# EasyEDA Pro project ProPrj_LXBRC-STM32F405飞控_2024-08-19.epro, board LXBRC-F405_V1.1
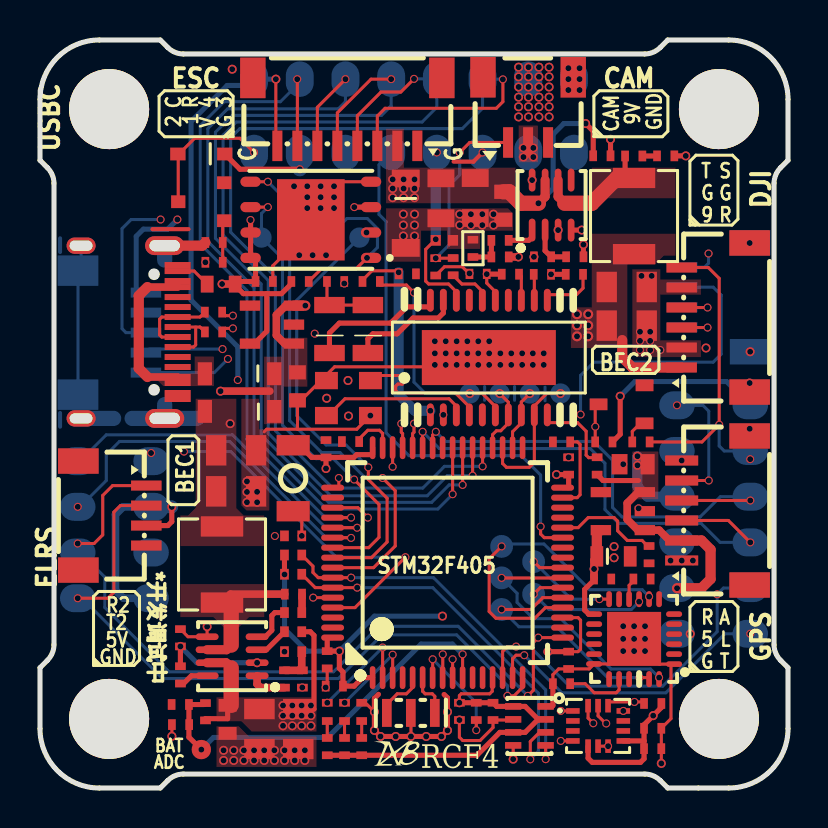
[diagram p3: board, top side]
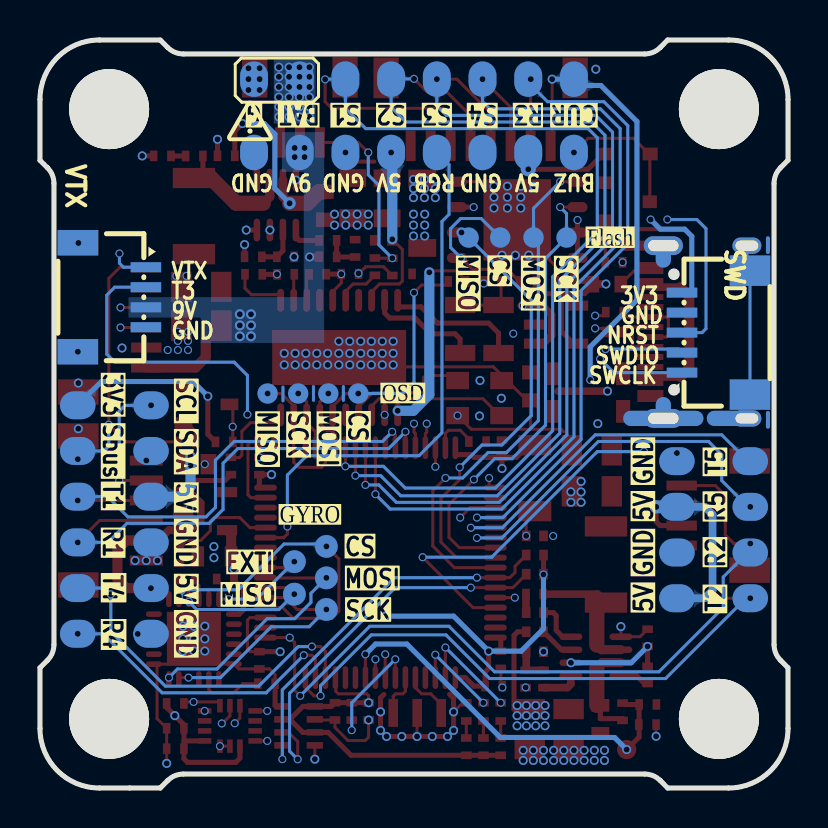
[diagram p4: board, bottom side, seen from below]

Outline 37.42 x 37.42 mm; copper layers: Top Layer, GND, PWR, Bottom Layer. Coordinates in mm from the lower left corner of the outline.
Outline path: 0,34.45 arc(0.87,36.55) 2.97,37.42 6.02,37.42 6.39,37.04 arc(6.75,36.8) 7.18,36.72 30.24,36.72 arc(30.67,36.8) 31.03,37.04 31.4,37.41 34.45,37.41 arc(36.55,36.55) 37.42,34.45 37.42,31.4 37.04,31.03 arc(36.8,30.67) 36.72,30.24 36.72,7.18 arc(36.8,6.75) 37.04,6.39 37.42,6.02 37.42,2.97 arc(36.55,0.87) 34.45,0 31.4,0 31.03,0.37 arc(30.67,0.61) 30.24,0.7 7.18,0.7 arc(6.75,0.61) 6.39,0.37 6.02,0 2.97,0 arc(0.87,0.87) 0,2.97 0,6.02 0.37,6.39 arc(0.61,6.75) 0.7,7.18 0.7,30.24 arc(0.61,30.67) 0.37,31.03 0,31.4 0,34.45
Stack: Top Layer 0.035mm 外层铜厚1oz / Dielectric1 0.2104mm 7628 RC49% 8.6mil / GND 0.035mm - / Dielectric2 1.065mm 1.1mm H/HOZ 含铜 / PWR 0.035mm - / Dielectric3 0.2104mm 7628 RC49% 8.6mil / Bottom Layer 0.035mm 外层铜厚1oz

## Design rules (mm)
net USB_DM: USB2
net USB_DP: USB2
net D+: USB
net D-: USB
template: 用户自定义配置
spacing Default (default): track to track 0.152, other pairs 0 to 0.152
track width Default (default): min 0.152, default 0.152, max 25.4
differential pair differentialPair (default): width min 0.127, default 0.254, max 2.54; gap min 0.152, default 0.152
via Default (default): diameter min 0.127, default 0.61, max 100.025; hole min 0.127, default 0.305, max 59.995

## Placement (name value [footprint] x y rotation side)
3V3  -  [led_0402]  16.09 3.81 270 top
AT7456E  AT7456E  [tssop-28_l9.7-w4.4-p0.65-ls6.4-bl-ep-2]  22.45 21.53 0 top
BMP280  BMP280  [wlga-8_l2.5-w2.0-p0.65-tr_dps422]  24.48 3.11 0 top
BOOT  TS2306A 200gf 002  [sw-smd_l3.0-w2.0-ls3.5]  12.66 15.5 90 top
C1A1  10uF  [c0805#2]  10.97 2.95 90 top
C1A2  10uF  [c0805]  21.77 29.51 90 top
C1B1  10uF  [c0805#2]  12.92 2.95 90 top
C1B2  10uF  [c0805]  20.05 29.5 90 top
C1C1  0.1uF  [c0603#2]  9.39 3.44 90 top
C1C2  0.1uF  [c0603#3]  23.17 29.12 90 top
C2A1  22uF  [c0805#2]  9.81 16.89 180 top
C2A2  22uF  [c0805#2]  29.35 25.06 180 top
C2B1  22uF  [c0805#2]  9.81 14.84 180 top
C2B2  22uF  [c0805#2]  29.35 23.13 180 top
C7  100nF  [C0402]  22.66 3.83 90 top
C8  100nF  [C0402]  11.21 25.34 180 top
C13  100nF  [c0402]  7.03 3.17 180 top
C19  1uF  [c0603]  12.88 20.09 90 top
C20  1uF  [c0603#4]  9.06 25.2 0 top
C21  100nF  [c0603#5]  29.69 16.2 0 top
C22  1uF  [cap-smd_l1.6-w0.8-rd]  28.69 11.59 180 top
C32  100nF  [C0402]  14.72 5.1 180 top
C33  100nF  [C0402]  26.44 16.11 90 top
C34  100nF  [C0402]  14.31 16.97 90 top
C35  100nF  [C0402]  20.98 3.83 270 top
C36  100nF  [C0402]  14.37 6.41 270 top
C37  100nF  [C0402]  26.44 6.39 270 top
C40  100nF  [C0402]  30.11 10.45 0 top
C41  100nF  [C0402]  28.14 10.45 180 top
C42  2.2nF  [C0402]  26.09 5.22 180 top
C203  100nF  [C0402]  12.67 9.7 180 top
C207  47uF  [case-a_3216]  16.4 22.96 90 top
C208  47uF  [case-a_3216]  14.48 22.96 90 top
C209  100nF  [c0402]  18.37 25.72 180 top
C210  100nF  [c0402#2]  20.23 27.39 180 top
C211  100nF  [c0402]  21.91 25.72 0 top
C212  100nF  [c0402]  20.67 26.08 90 top
C242  2.2uF  [C0402]  26.09 17.31 180 top
C243  2.2uF  [C0402]  15.53 17.33 180 top
C244  100nF  [C0402]  7.02 7.51 270 top
C245  100nF  [C0402]  29.7 31.61 180 top
C246  100nF  [C0402]  25.14 26.57 0 top
C247  100nF  [C0402]  30.65 1.97 0 top
C248  10nF  [C0402]  30.65 2.99 0 top
CAM  WTB01W03BB  [conn-smd_3p-p1.00_bzcn_wtb01w03bb]  24.41 33.54 0 top
D1  B5819WS  [sod-323_l1.8-w1.3-ls2.5-rd]  8.07 31.71 180 top
D301  SMF33A  [sod-123fl_l2.7-w1.8-ls3.8-rd]  18.3 28.75 270 top
D305  B5819W  [sod-123f_l2.7-w1.6-ls3.8-rd-1]  9.98 20.72 180 top
D306  B5819W  [sod-123f_l2.7-w1.6-ls3.8-rd-1]  9.98 18.84 180 top
DJI  ZX-SH1.0-6PWT  [conn-smd_6p-p1.00_megastar_zx-sh1.0-6pwt#2]  33.8 23.53 90 top
ELRS  ZX-SH1.0-4PWT  [conn-smd_4p-p1.00_megastar_zx-sh1.0-4pwt]  3.62 13.63 270 top
ESC  A1002WR-S-8P  [conn-smd_8p-p1.00_megastar_zx-sh1.0-8pwt]  15.37 33.82 180 top
FC  -  [led_0402]  14.37 3.81 270 top
G2  -  [通孔焊盘#4]  35.53 10 180 bottom
G3  -  [通孔焊盘]  35.53 7.72 180 top
G4  -  [通孔焊盘]  1.89 9.49 0 top
G7  -  [通孔焊盘]  35.53 14.57 180 top
G8  -  [通孔焊盘]  35.53 12.29 0 top
G9  -  [通孔焊盘#2]  12.73 27.53 0 top
G10  -  [通孔焊盘#2]  15.98 27.53 0 top
G11  -  [通孔焊盘#2]  11.08 27.53 0 top
G12  -  [通孔焊盘#2]  14.4 27.53 0 top
G13  -  [通孔焊盘]  1.89 11.78 180 top
G14  -  [通孔焊盘#4]  31.86 16.86 0 bottom
G15  -  [通孔焊盘#4]  31.86 19.14 0 bottom
G16  -  [通孔焊盘#3]  23.09 12.09 180 top
G17  -  [通孔焊盘#3]  23.09 8.93 90 top
G18  -  [通孔焊盘#3]  24.69 9.7 90 top
G19  -  [通孔焊盘#3]  23.09 10.51 90 top
G20  -  [通孔焊盘#3]  24.69 11.32 90 top
G21  -  [通孔焊盘#2]  22.99 19.73 90 top
G22  -  [通孔焊盘#2]  26.03 19.73 90 top
G23  -  [通孔焊盘#2]  24.5 19.73 90 top
G24  -  [通孔焊盘#2]  21.5 19.73 90 top
GPS  ZX-SH1.0-6PWT  [conn-smd_6p-p1.00_megastar_zx-sh1.0-6pwt]  33.8 13.88 90 top
HP15  -  [通孔焊盘#5]  8.07 1.92 0 bottom
ICM-42688P  ICM-42688-P  [LGA-14_L3.0-W2.5-P0.50-TL]  27.92 3.11 0 top
L201  10uH  [ind-smd_l4.4-w4.2]  9.11 11.18 270 top
L202  10uH  [ind-smd_l4.4-w4.2]  29.71 28.61 90 top
LDO  CJ6206B33M  [sot-23-5_l2.9-w1.6-p0.95-ls2.8-bl]  11.6 23.18 90 top
LDO_GYRO  CJ6206B33M  [sot-23-5_l2.9-w1.6-p0.95-ls2.8-bl]  29.16 13.85 90 top
LXB  -  [led_0402]  15.23 3.81 270 top
MP9943_5V  MP9943GQ-Z  [qfn-8_l3.0-w3.0-p0.65-bl]  9.61 6.59 90 top
MP9943_9V  MP9943GQ-Z  [qfn-8_l3.0-w3.0-p0.65-bl]  25.59 29.16 0 top
MPU6000  MPU-6000  [qfn-24_l4.0-w4.0-p0.50-bl-ep2.7]  29.72 7.45 90 top
NOREF  -  [Pad_e38]  22.14 35.46 90 top
NOREF#2  -  [Pad_e51]  24.42 31.79 90 top
NOREF#3  -  [Pad_e94]  12.99 31.79 270 top
NOREF#4  -  [Pad_e54]  12.99 35.46 270 top
NOREF#5  -  [Pad_e43]  31.86 14.57 0 top
NOREF#6  -  [Pad_e30]  10.71 35.46 90 top
NOREF#7  -  [Pad_e27]  5.56 14.06 0 top
NOREF#8  -  [Pad_e25]  26.71 35.46 90 top
NOREF#9  -  [Pad_e41]  31.86 10 0 top
NOREF#10  -  [Pad_e525]  1.89 16.35 0 top
NOREF#11  -  [Pad_e40]  31.86 7.72 0 top
NOREF#12  -  [Pad_e99]  10.71 31.79 90 top
NOREF#13  -  [Pad_e45]  31.86 12.29 0 top
NOREF#14  -  [Pad_e18]  35.53 19.14 0 top
NOREF#15  -  [Pad_e26]  15.28 35.46 90 top
NOREF#16  -  [Pad_e1174]  3.46 3.46 225 top
NOREF#17  -  [Pad_e113]  22.14 31.79 90 top
NOREF#18  -  [Pad_e55]  26.71 31.79 90 top
NOREF#19  -  [Pad_e112]  17.56 31.79 90 top
NOREF#20  -  [Pad_e566]  5.56 9.49 0 top
NOREF#21  -  [Pad_e36]  17.56 35.46 270 top
NOREF#22  -  [Pad_e1169]  3.46 33.96 135 top
NOREF#23  -  [Pad_e1170]  33.96 33.96 225 top
NOREF#24  -  [Pad_e33]  24.42 35.46 90 top
NOREF#25  -  [Pad_e534]  5.56 11.78 0 top
NOREF#26  -  [Pad_e28]  19.85 35.46 270 top
NOREF#27  -  [Pad_e95]  15.28 31.79 270 top
NOREF#28  -  [Pad_e1171]  33.96 3.46 135 top
NOREF#29  -  [Pad_e522]  1.89 14.06 0 top
NOREF#30  -  [Pad_e114]  19.85 31.79 90 top
NOREF#31  -  [Pad_e24]  5.56 16.35 0 top
Q1  -  [s8050_sot-23]  8.06 29.2 0 top
Q2  -  [s8050_sot-23#2]  29.09 19.06 0 top
R3  560R  [r0402#2]  15.23 2.07 270 top
R4  560R  [r0402#2]  14.37 2.07 270 top
R11  10K  [r0402#2]  13.01 25.34 180 top
R16  10K  [r0402#2]  21.82 3.83 90 top
R17  27  [r0402#2]  8.68 23.8 180 top
R18  27  [r0402#2]  8.68 22.81 180 top
R20  10K  [r0402]  12.66 12.61 0 top
R21  1K  [r0402#2]  7.02 4.18 0 top
R22  10K  [r0402#2]  8.28 3.81 270 top
R23  10K  [r0402#2]  30.46 11.67 90 top
R24  100R  [r0402#2]  8.71 26.3 180 top
R25  10K  [r0402#2]  8.71 27.29 0 top
R26  10K  [r0402#2]  28.2 17.31 0 top
R27  1K  [r0402#2]  30.06 17.31 0 top
R30  4.7K  [r0402]  12.66 11.65 180 top
R31  4.7K  [r0402]  12.66 10.69 180 top
R207  1K  [r0402#2]  27.87 16.11 270 top
R208  1K  [r0402#2]  26.73 25.7 180 top
R209  1K  [r0402#2]  25.13 25.7 0 top
R210  1K  [r0402#2]  23.53 25.7 180 top
R211  75R  [r0402#2]  19.79 26.07 90 top
R212  75R  [r0402#2]  14.79 25.34 0 top
R230  20R  [r0402]  12.66 8.77 0 top
R231  41.2K  [r0402]  12.66 6.82 180 top
R232  7.68K  [r0402#2]  13.12 5.45 90 top
R233  51K  [r0402#2]  12.23 5.45 270 top
R234  1M  [r0402]  12.66 7.82 0 top
R235  100K  [r0402#2]  7.02 5.66 90 top
R236  20R  [r0402#2]  31.3 31.62 180 top
R237  41.2K  [r0402#2]  23.01 26.56 0 top
R238  4k  [r0402#2]  21.66 26.99 270 top
R239  51K  [r0402#2]  23.01 27.39 0 top
R240  1M  [r0402#2]  28.1 31.62 180 top
R241  100K  [r0402#2]  26.75 26.57 180 top
R242  10K  [r0402#2]  30.65 4.23 0 top
R243  10K  [r0402#2]  16.56 25.34 180 top
R244  560R  [r0402#2]  16.09 2.07 270 top
RC1  -  [通孔焊盘]  35.53 16.86 180 top
STM32F405  STM32F405RGT6V  [lqfp-64_l10.0-w10.0-p0.50-ls12.0-bl]  20.39 11.27 0 top
SWD  A1002WR-S-5P  [conn-smd_5p-p1.00_megastar_zx-sh1.0-5pwt]  3.6 22.78 90 bottom
USBC  KH-TYPE-C-16P  [usb-c-smd_kh-type-c-16p]  4.47 22.81 270 top
VTX  ZX-SH1.0-4PWT  [conn-smd_4p-p1.00_megastar_zx-sh1.0-4pwt]  33.82 24.55 270 bottom
W25Q128  W25Q128JVPIQ  [wson-8_l6.0-w5.0-p1.27-bl-ep]  13.55 28.42 90 top
X2  8MHz  [osc-smd_3p-l3.2-w1.3-p1.2-l]  18.55 3.76 180 top
X3  27MHz  [osc-smd_4p-l3.2-w2.5-bl]  15.43 19.5 180 top

## Footprints (pads in the part's own frame, mm; a bottom-side part is the same pattern mirrored in y, then rotated)
c0402
  rect 0.381x0.508 smd: 1(-0.432,0) 2(0.432,0)
c0402#2
  rect 0.508x0.533 smd: 1(-0.432,0) 2(0.432,0)
C0402
  rect 0.381x0.533 smd: 1(-0.432,0) 2(0.432,0)
c0603
  rect 0.711x0.838 smd: 1(-0.7,0) 2(0.7,0)
c0603#2
  rect 0.635x0.9 smd: 1(-0.7,0) 2(0.7,0)
c0603#3
  rect 0.711x0.9 smd: 1(-0.7,0) 2(0.7,0)
c0603#4
  rect 0.635x0.838 smd: 1(-0.7,0) 2(0.7,0)
c0603#5
  rect 0.787x1.016 smd: 1(-0.7,0)
  rect 0.711x1.016 smd: 2(0.7,0)
c0805
  rect 0.889x1.346 smd: 1(-1,0) 2(1,0)
c0805#2
  rect 1.016x1.524 smd: 1(-1,0) 2(1,0)
cap-smd_l1.6-w0.8-rd
  rect 0.635x1.016 smd: 1(0.835,0) 2(-0.835,0)
case-a_3216
  rect 0.813x1.524 smd: 1(-1.2,0) 2(1.2,0)
conn-smd_3p-p1.00_bzcn_wtb01w03bb
  rect 0.5x1.524 smd: 1(-1,-1.25) 2(0,-1.25) 3(1,-1.25)
  rect 1.27x2.032 smd: 4(2.257,2.013) 5(-2.257,2.013)
conn-smd_4p-p1.00_megastar_zx-sh1.0-4pwt
  rect 0.5x1.524 smd: 1(-1.5,1.7) 2(-0.5,1.7) 3(0.5,1.7) 4(1.5,1.7)
  rect 1.27x2.032 smd: 5(2.727,-1.7) 6(-2.727,-1.7)
conn-smd_5p-p1.00_megastar_zx-sh1.0-5pwt
  rect 0.5x1.524 smd: 1(-2,1.7) 2(-1,1.7) 3(0,1.7) 4(1,1.7) 5(2,1.7)
  rect 1.524x2.032 smd: 6(3.1,-1.7) 7(-3.1,-1.7)
conn-smd_6p-p1.00_megastar_zx-sh1.0-6pwt
  rect 0.5x1.651 smd: 1(-2.5,1.7) 2(-1.5,1.7) 3(-0.5,1.7) 4(0.5,1.7) 5(1.5,1.7) 6(2.5,1.7)
  rect 1.27x2.032 smd: 7(3.727,-1.7) 8(-3.727,-1.7)
conn-smd_6p-p1.00_megastar_zx-sh1.0-6pwt#2
  rect 0.5x1.524 smd: 1(-2.5,1.7) 2(-1.5,1.7) 3(-0.5,1.7) 4(0.5,1.7) 5(1.5,1.7) 6(2.5,1.7)
  rect 1.27x2.032 smd: 7(3.727,-1.7) 8(-3.727,-1.7)
conn-smd_8p-p1.00_megastar_zx-sh1.0-8pwt
  rect 0.5x1.524 smd: 1(-3.5,1.7) 2(-2.5,1.7) 3(-1.5,1.7) 4(-0.5,1.7) 5(0.5,1.7) 6(1.5,1.7) 7(2.5,1.7) 8(3.5,1.7)
  rect 1.27x2.032 smd: 9(4.727,-1.7) 10(-4.727,-1.7)
ind-smd_l4.4-w4.2
  rect 1.016x2.12 smd: 1(1.905,0) 2(-1.905,0)
led_0402
  rect 0.381x0.533 smd: 1(-0.457,0) 2(0.457,0)
LGA-14_L3.0-W2.5-P0.50-TL
  rect 0.675x0.28 smd: 1(-1.262,0.75) 2(-1.262,0.25) 3(-1.262,-0.25) 4(-1.262,-0.75) 8(1.262,-0.75) 9(1.262,-0.25) 10(1.262,0.25) 11(1.262,0.75)
  rect 0.28x0.675 smd: 5(-0.5,-1.012) 6(0,-1.012) 7(0.5,-1.012) 12(0.5,1.012) 13(0,1.012) 14(-0.5,1.012)
lqfp-64_l10.0-w10.0-p0.50-ls12.0-bl
  oval 0.28x1.143 smd: 1(-3.75,-5.75) 2(-3.25,-5.75) 3(-2.75,-5.75) 4(-2.25,-5.75) 5(-1.75,-5.75) 6(-1.25,-5.75) 7(-0.75,-5.75) 8(-0.25,-5.75) 9(0.25,-5.75) 10(0.75,-5.75) 11(1.25,-5.75) 12(1.75,-5.75) 13(2.25,-5.75) 14(2.75,-5.75) 15(3.25,-5.75) 16(3.75,-5.75) 33(3.75,5.75) 34(3.25,5.75) 35(2.75,5.75) 36(2.25,5.75) 37(1.75,5.75) 38(1.25,5.75) 39(0.75,5.75) 40(0.25,5.75) 41(-0.25,5.75) 42(-0.75,5.75) 43(-1.25,5.75) 44(-1.75,5.75) 45(-2.25,5.75) 46(-2.75,5.75) 47(-3.25,5.75) 48(-3.75,5.75)
  oval 1.143x0.3 smd: 17(5.75,-3.75) 18(5.75,-3.25) 19(5.75,-2.75) 20(5.75,-2.25) 21(5.75,-1.75) 22(5.75,-1.25) 23(5.75,-0.75) 24(5.75,-0.25) 25(5.75,0.25) 26(5.75,0.75) 27(5.75,1.25) 28(5.75,1.75) 29(5.75,2.25) 30(5.75,2.75) 31(5.75,3.25) 32(5.75,3.75) 49(-5.75,3.75) 50(-5.75,3.25) 51(-5.75,2.75) 52(-5.75,2.25) 53(-5.75,1.75) 54(-5.75,1.25) 55(-5.75,0.75) 56(-5.75,0.25) 57(-5.75,-0.25) 58(-5.75,-0.75) 59(-5.75,-1.25) 60(-5.75,-1.75) 61(-5.75,-2.25) 62(-5.75,-2.75) 63(-5.75,-3.25) 64(-5.75,-3.75)
osc-smd_3p-l3.2-w1.3-p1.2-l
  rect 0.482x1.397 smd: 1(-1.2,0) 2(0,0) 3(1.2,0)
osc-smd_4p-l3.2-w2.5-bl
  rect 1.143x0.864 smd: 1(-1.1,-0.875) 2(1.1,-0.875) 3(1.1,0.875) 4(-1.1,0.875)
Pad_e18
  rrect 1.778x1.397 smd far side: 1(0,0)
Pad_e24
  rrect 1.778x1.397 smd far side: 1(0,0)
Pad_e25
  rrect 1.778x1.397 smd far side: 1(0,0)
Pad_e26
  rrect 1.778x1.397 smd far side: 1(0,0)
Pad_e27
  rrect 1.778x1.397 smd far side: 1(0,0)
Pad_e28
  rrect 1.778x1.397 smd far side: 1(0,0)
Pad_e30
  rrect 1.778x1.397 smd far side: 1(0,0)
Pad_e33
  rrect 1.778x1.397 smd far side: 1(0,0)
Pad_e36
  rrect 1.778x1.397 smd far side: 1(0,0)
Pad_e38
  rrect 1.778x1.397 smd far side: 1(0,0)
Pad_e40
  rrect 1.778x1.397 smd far side: 1(0,0)
Pad_e41
  rrect 1.778x1.397 smd far side: 1(0,0)
Pad_e43
  rrect 1.778x1.397 smd far side: 1(0,0)
Pad_e45
  rrect 1.778x1.397 smd far side: 1(0,0)
Pad_e51
  rrect 1.778x1.397 smd far side: 1(0,0)
Pad_e54
  rrect 1.778x1.397 smd far side: 1(0,0)
Pad_e55
  rrect 1.778x1.397 smd far side: 1(0,0)
Pad_e94
  rrect 1.778x1.397 smd far side: 1(0,0)
Pad_e95
  rrect 1.778x1.397 smd far side: 1(0,0)
Pad_e99
  rrect 1.778x1.397 smd far side: 1(0,0)
Pad_e112
  rrect 1.778x1.397 smd far side: 1(0,0)
Pad_e113
  rrect 1.778x1.397 smd far side: 1(0,0)
Pad_e114
  rrect 1.778x1.397 smd far side: 1(0,0)
Pad_e522
  rrect 1.778x1.397 smd far side: 1(0,0)
Pad_e525
  rrect 1.778x1.397 smd far side: 1(0,0)
Pad_e534
  rrect 1.778x1.397 smd far side: 1(0,0)
Pad_e566
  rrect 1.778x1.397 smd far side: 1(0,0)
Pad_e1169
  oval 4x4 hole 4: 1(0,0)
Pad_e1170
  oval 4x4 hole 4: 1(0,0)
Pad_e1171
  oval 4x4 hole 4: 1(0,0)
Pad_e1174
  oval 4x4 hole 4: 1(0,0)
qfn-8_l3.0-w3.0-p0.65-bl
  oval 0.33x1.143 smd: 1(-0.975,-1.25) 2(-0.325,-1.25) 3(0.325,-1.25) 4(0.975,-1.25) 5(0.975,1.25) 6(0.325,1.25) 7(-0.325,1.25) 8(-0.975,1.25)
qfn-24_l4.0-w4.0-p0.50-bl-ep2.7
  oval 0.28x0.8 smd: 1(-1.25,-2) 2(-0.75,-2) 3(-0.25,-2) 4(0.25,-2) 5(0.75,-2) 6(1.25,-2) 13(1.25,2) 14(0.75,2) 15(0.25,2) 16(-0.25,2) 17(-0.75,2) 18(-1.242,2)
  oval 0.8x0.28 smd: 7(2,-1.25) 8(2,-0.75) 9(2,-0.25) 10(2,0.25) 11(2,0.75) 12(2,1.25) 19(-2,1.25) 20(-2,0.75) 21(-2,0.25) 23(-2,-0.75) 24(-2,-1.25)
  rect 2.7x2.7 smd: 25(0.013,0)
r0402
  rect 0.432x0.533 smd: 1(-0.433,0) 2(0.433,0)
r0402#2
  rect 0.381x0.533 smd: 1(-0.433,0) 2(0.433,0)
s8050_sot-23
  rect 0.711x0.635 smd: 1(1.15,-0.823) 2(1.15,1.077) 3(-1.15,0.127)
s8050_sot-23#2
  rect 0.889x0.584 smd: 1(1.15,-0.823) 2(1.15,1.077) 3(-1.15,0.127)
sod-123f_l2.7-w1.6-ls3.8-rd-1
  rect 0.711x1.143 smd: 1(-1.735,0) 2(1.735,0)
sod-123fl_l2.7-w1.8-ls3.8-rd
  rect 0.889x1.397 smd: 1(-1.735,0) 2(1.735,0)
sod-323_l1.8-w1.3-ls2.5-rd
  rect 0.762x0.635 smd: 1(-1.173,0) 2(1.173,0)
sot-23-5_l2.9-w1.6-p0.95-ls2.8-bl
  rect 0.508x1.016 smd: 1(-0.95,-1.1) 2(0,-1.1) 3(0.95,-1.1) 4(0.95,1.1) 5(-0.95,1.1)
sw-smd_l3.0-w2.0-ls3.5
  rect 1.016x1.651 smd: 1(-1.651,0) 2(1.651,0)
tssop-28_l9.7-w4.4-p0.65-ls6.4-bl-ep-2
  oval 0.343x1.143 smd: 3(-2.925,-2.866) 4(-2.275,-2.866) 5(-1.625,-2.866) 6(-0.975,-2.866) 7(-0.325,-2.866) 8(0.325,-2.866) 9(0.975,-2.866) 10(1.625,-2.866) 11(2.275,-2.866) 12(2.925,-2.866) 17(2.925,2.866) 18(2.275,2.866) 19(1.625,2.866) 20(0.975,2.866) 21(0.325,2.866) 22(-0.325,2.866) 23(-0.975,2.866) 24(-1.625,2.866) 25(-2.275,2.866) 26(-2.925,2.866)
  rect 6.7x2.75 smd: 29(0,0)
usb-c-smd_kh-type-c-16p
  oval 0.94x1.956 hole 0.559x1.524: 1(-4.32,1.765) 2(4.32,1.765)
  oval 0.813x1.448 hole 0.508x1.143: 3(-4.32,-2.415) 4(4.32,-2.415)
  rect 0.3x1.3 smd: A1(-3.35,2.415) A4(-2.55,2.415) A5(-1.25,2.415) A6(-0.25,2.415) A7(0.25,2.415) A8(1.25,2.415) A9(2.55,2.415) A12(3.35,2.415) B1(3.05,2.415) B4(2.25,2.415) B5(1.75,2.415) B6(0.75,2.415) B7(-0.75,2.415) B8(-1.75,2.415) B9(-2.25,2.415) B12(-3.05,2.415)
wlga-8_l2.5-w2.0-p0.65-tr_dps422
  rect 0.813x0.33 smd: 1(0.813,0.975) 2(0.813,0.325) 3(0.813,-0.325) 4(0.813,-0.975) 5(-0.813,-0.975) 6(-0.813,-0.325) 7(-0.813,0.325) 8(-0.813,0.975)
wson-8_l6.0-w5.0-p1.27-bl-ep
  oval 0.508x1.016 smd: 1(-1.905,-3.013) 2(-0.635,-3.013) 3(0.635,-3.013) 4(1.905,-3.013) 5(1.905,3.013) 6(0.635,3.013) 7(-0.635,3.013) 8(-1.905,3.013)
  rect 4.064x3.378 smd: 9(0,0)
通孔焊盘
  rrect 1.778x1.397 smd far side: 1(0,0)
通孔焊盘#2
  round 1.016 smd far side: 1(0,0)
通孔焊盘#3
  round 1.143 smd far side: 1(0,0)
通孔焊盘#4
  rrect 1.778x1.397 smd: 1(0,0)
通孔焊盘#5
  round 0.965 smd far side: 1(0,0)

## Nets
As in the schematic, except:
3V3: BMP280.2 BMP280.6 BMP280.8 BOOT.2 C7.2 C8.2 C20.2 C32.1 C33.1 C34.1 C35.1 C36.1 C37.1 LDO.5 NOREF#14.1 R3.2 R4.2 R11.2 R16.2 R26.2 R30.2 R31.2 R244.2 STM32F405.1 STM32F405.13 STM32F405.19 STM32F405.32 STM32F405.48 STM32F405.64 SWD.5 W25Q128.3 W25Q128.7 W25Q128.8
5V: AT7456E.3 AT7456E.21 AT7456E.24 C19.2 C21.2 C209.2 C210.2 C211.2 D1.1 D305.1 D306.1 ELRS.3 GPS.2 LDO.1 LDO.3 LDO_GYRO.1 LDO_GYRO.3 NOREF#3.1 NOREF#5.1 NOREF#7.1 NOREF#9.1 NOREF#20.1 NOREF#30.1 R207.2 R208.2 R209.2 R210.2 R243.2
GND: 3V3.1 AT7456E.4 AT7456E.20 AT7456E.23 AT7456E.29 BMP280.1 BMP280.5 BMP280.7 C1A1.1 C1A2.1 C1B1.1 C1B2.1 C1C1.1 C1C2.1 C2A1.1 C2A2.1 C2B1.1 C2B2.1 C7.1 C8.1 C13.2 C19.1 C20.1 C21.1 C22.2 C32.2 C33.2 C34.2 C35.2 C36.2 C37.2 C40.2 C41.1 C42.2 C209.1 C210.1 C211.1 C242.2 C243.2 C244.1 C246.1 C247.2 C248.2 CAM.3 CAM.4 CAM.5 D301.2 DJI.2 DJI.5 DJI.7 DJI.8 ELRS.4 ELRS.5 ELRS.6 ESC.1 ESC.9 ESC.10 GPS.1 GPS.7 GPS.8 ICM-42688P.6 ICM-42688P.7 ICM-42688P.11 LDO.2 LDO_GYRO.2 MP9943_5V.5 MP9943_9V.5 MPU6000.1 MPU6000.18 MPU6000.25 NOREF#8.1 NOREF#11.1 NOREF#13.1 NOREF#17.1 NOREF#18.1 NOREF#25.1 NOREF#27.1 NOREF#31.1 Q1.2 Q2.2 R20.1 R21.1 R23.1 R25.1 R211.1 R232.1 R238.1 STM32F405.12 STM32F405.18 STM32F405.63 SWD.4 SWD.6 SWD.7 USBC.1 USBC.2 USBC.3 USBC.4 USBC.A1 USBC.A12 USBC.B1 USBC.B12 VTX.4 VTX.5 VTX.6 W25Q128.4 W25Q128.9 X2.2 X3.2 X3.4
VBAT: C1A1.2 C1A2.2 C1B1.2 C1B2.2 C1C1.2 C1C2.2 D301.1 ESC.2 MP9943_5V.7 MP9943_9V.7 NOREF#24.1 R22.2 R234.2 R240.2
ADC_CURR: ESC.8 NOREF#6.1 STM32F405.9
BUZ-: D1.2 NOREF#12.1 Q1.3
DC_9V: C2A2.2 C2B2.2 CAM.2 DJI.1 L202.2 NOREF#2.1 R237.2 VTX.3
LED_STRIP: NOREF#19.1 STM32F405.27
S1: ESC.3 NOREF.1 STM32F405.37
S2: ESC.4 NOREF#26.1 STM32F405.38
S3: ESC.5 NOREF#21.1 STM32F405.39
S4: ESC.6 NOREF#15.1 STM32F405.40
UART5_RX: NOREF#29.1 STM32F405.54
UART5_TX: NOREF#10.1 STM32F405.53
USART3_RX: ESC.7 NOREF#4.1 STM32F405.52

Pads without a net: AT7456E 7; ICM-42688P 2 3 9 10; LDO 4; LDO_GYRO 4; MPU6000 2 3 4 5 6 7 11 14 15 16 17 19 21; NOREF#16 1; NOREF#22 1; NOREF#23 1; NOREF#28 1; STM32F405 4 11 25 26 29 30 33 41 50 62; USBC A5 A8 B5 B8

## Via types
v1: diameter 0.4, hole 0.3, Top Layer to Bottom Layer, 128 vias
v2: diameter 0.45, hole 0.3, Top Layer to Bottom Layer, 205 vias
v3: diameter 0.5, hole 0.3, Top Layer to Bottom Layer, 6 vias
v4: diameter 0.61, hole 0.305, Top Layer to Bottom Layer, 1 via

## Routing (per net, layer and track width the routed paths; a pad name or vN(x,y) marks a point on that pad's centre or on a via; arc(x,y) is an arc through that point)
3V3: length 138.1
  Top Layer w0.152: STM32F405.19 26.91,8.52 27.04,8.4 27.04,6.95 26.91,6.82 C37.1 ; v2(20.98,4.27) 20.98,4.62 21.07,4.71 22.49,4.71 22.62,4.84 22.62,5.5 STM32F405.13
  Top Layer w0.254: 11.34,24.73 10.17,24.73 9.76,25.14 C20.2 9.89,25.34 C8.2 10.78,26.52 W25Q128.8 W25Q128.7 10.53,28.41 v1(10.53,28.41) ; 11.34,24.73 12.08,24.73 12.57,25.22 R11.2 ; 11.34,24.73 11.34,22.85 10.72,22.23 10.45,22.23 ; v2(25.83,15.68) C33.1 26.44,15.02 STM32F405.32 ; C34.1 15.7,16.54 15.84,16.68 16.64,16.68 STM32F405.48 ; C34.1 v2(14.31,15.98) ; C34.1 13.59,16.54 12.98,17.15 BOOT.2 ; 24.92,3.43 24.27,2.78 BMP280.6 23,2.78 21.86,1.64 R244.2 R3.2 R4.2 ; 24.92,3.43 BMP280.2 ; 24.92,3.43 24.27,4.08 BMP280.8 22.84,4.08 22.66,4.27 v2(20.98,4.27) ; R31.2 R30.2 ; R26.2 29.02,17.69 v2(29.02,19.6) ; STM32F405.64 14.37,7.52 C36.1 v2(14.97,6.85) 14.97,5.98 15.15,5.8 C32.1 15.71,5.1 16.14,5.52 STM32F405.1 ; v2(25.4,6.82) C37.1 ; v1(15.72,29.06) W25Q128.3
  Top Layer w0.381: C20.2 9.76,25.21 v2(9.11,25.21)
  PWR w0.254: 22.31,4.27 v2(20.98,4.27) ; 22.31,4.27 22.58,4 24.93,4 25.4,4.47 v2(25.4,6.82) 25.4,7.9 24.19,9.11 24.19,15.09 24.78,15.68 v2(25.83,15.68) 27.78,15.68 29.02,16.92 v2(29.02,19.6) ; 22.31,4.27 22.31,6.41 v2(20.13,8.6) 16.13,8.6 14.97,9.75 14.97,14.19 14.31,14.85 v2(14.31,15.98) 12.33,17.95 12.33,18.81 10.24,20.91 9.28,20.91 8.65,21.54 8.65,24.75 v2(9.11,25.21) ; v1(6.87,28.44) 6.9,28.41 v1(10.53,28.41) 15.08,28.41 v1(15.72,29.06)
  Bottom Layer w0.254: v2(20.13,8.6) 16.73,8.6 v2(14.97,6.85) 13.35,6.85 12.23,7.96 v1(12.23,10.68) ; v1(6.87,28.44) 6.39,27.95 5.17,27.95 4.81,27.6 4.81,24.78 SWD.5 ; NOREF#14.1 34.34,20.33 29.76,20.33 v2(29.02,19.6)
3V3_GYRO: length 23.6
  Top Layer w0.254: C247.1 30.21,2.36 ; 30.21,2.36 C248.1 30.21,3.16 v2(30.67,3.62) 31.08,4.03 R242.2 ; 30.21,2.36 ICM-42688P.8 ; MPU6000.13 27.45,8.7 27.24,8.9 27.24,9.93 27.76,10.45 ; ICM-42688P.5 27.42,1.49 27.62,1.28 30.04,1.28 30.21,1.46 30.21,1.97
  Top Layer w0.381: 27.71,10.5 v2(27.71,10.96) 27.71,11.4 27.9,11.59
  Top Layer w0.508: 28.11,12.9 27.85,12.9 27.85,11.64
  PWR w0.254: v2(30.67,3.62) 30.67,3.98 31.94,5.25 31.94,8.8 29.79,10.96 v2(27.71,10.96)
5V: length 104.9
  Top Layer w0.152: v1(22.35,25.7) 22.35,25.26 22.78,24.83 AT7456E.21 ; AT7456E.24 20.83,24.82 20.43,25.21 19.44,25.21 19.29,25.36 19.29,26.94 v1(19.79,27.45) ; R243.2 16.13,25.4 16.6,25.87 17.79,25.87
  Top Layer w0.254: R207.2 28.16,15.38 29.93,15.38 ; R210.2 23.09,25.7 v1(22.35,25.7) ; D1.1 10,30.95 v1(12.99,30.95) ; v1(25.56,25.7) R208.2 ; v2(6.59,14.06) 6.59,13.32 6.4,13.13 ELRS.3
  Top Layer w0.381: v2(9.03,19.85) 11.49,19.85 ; 30.31,14.8 29.92,14.8 29.37,14.25 29.37,13.43 29.91,12.9 30.97,12.9 31.49,12.38 GPS.2 ; 12.68,24.13 12.29,24.13 11.82,23.66 11.82,22.64 12.24,22.23 12.68,22.23
  Top Layer w0.508: GPS.2 33.09,12.38 33.54,11.93 33.54,10.45 33.08,10 v2(31.86,10) ; v1(13.27,24.13) LDO.3
  PWR w0.381: 16.9,25.79 16.9,30.13 16.09,30.95 13.04,30.95 ; 16.9,25.79 v1(17.94,25.79) 19.59,27.45 v1(19.79,27.45) 20.6,27.45 v1(22.35,25.7) 25.55,25.7 v1(25.56,25.7) ; 16.9,25.79 14.94,25.79 v1(13.27,24.13)
  PWR w0.508: v2(29.88,16.14) v2(29.88,16.6) 29.88,19.88 29.3,20.46 20.11,20.46 19.53,19.88 v1(19.53,18.87) ; v2(9.03,19.85) 8.52,19.34 8.52,15.99 v2(6.59,14.06)
  Bottom Layer w0.381: NOREF#20.1 4.17,9.49 3.77,9.89 3.77,13.68 4.16,14.06 NOREF#7.1
  Bottom Layer w0.508: v1(17.94,25.79) 17.94,19.68 18.75,18.87 v1(19.53,18.87) ; NOREF#5.1 30.39,14.57 29.88,15.08 v2(29.88,16.14) v2(29.88,16.6) ; v1(19.79,27.45) 19.79,31.73 v1(19.85,31.79)
  Bottom Layer w0.635: NOREF#7.1 6.59,14.06 v2(6.59,14.06)
  Bottom Layer w0.762: 12.99,30.98 NOREF#3.1
GND: length 83.4
  Top Layer w0.152: MPU6000.1 31.56,6.2 ; 31.56,6.2 30.98,6.2 v2(29.72,7.46) 28.46,6.21 MPU6000.18 27.47,5.96 C37.2 25.94,5.96 25.65,5.67 C42.2 ; 31.56,6.2 31.56,3.47 31.08,2.99 v2(31.08,1.23) ; C20.1 7.71,25.86 USBC.B12 ; AT7456E.29 21.99,21.07 14.74,21.07 13.06,19.39 C19.1 12.88,17.95 ; BMP280.7 23.64,3.4 C7.1 22.66,3.03 22.01,2.38 21.15,2.38 20.98,2.54 v2(20.98,3.4) ; v2(18.56,2.58) 18.56,3.75 X2.2 ; W25Q128.4 14.93,30.33 v2(14.71,30.1) ; ICM-42688P.6 v1(28.42,2.09) ; 3V3.1 16.27,4.27 v2(16.73,3.81) ; C32.2 14.37,5.17 C36.2 ; 12.88,17.95 11.34,17.95 11.21,17.82 ; 12.88,17.95 15.84,17.95 v1(16.53,18.63) ; 19.79,25.64 20.23,26.07 21.12,26.07 21.45,25.74 v1(21.48,25.74) ; C244.1 7.4,7.57 8.36,7.57 v2(8.36,8.07) ; W25Q128.9 13.55,28.02 11.65,26.12 C8.1 ; BMP280.5 v2(23.67,1.44) ; 35.5,20.26 DJI.8 ; 6.6,2.59 C13.2
  Top Layer w0.203: 5.63,27.95 7.43,27.95 ; 20.69,31.33 21.68,31.33 v1(22.14,31.79)
  Top Layer w0.254: 16.93,4.69 16.73,4.48 v2(16.73,3.81) v2(16.73,2.88) v2(17.03,2.58) v2(17.79,2.58) v2(18.56,2.58) v2(19.32,2.58) v2(20.08,2.58) v2(20.38,2.88) v2(20.38,3.81) 20.38,4.51 20.21,4.68 ; C42.2 25.65,4.13 25.61,4.08 BMP280.1
  Top Layer w0.508: USBC.1 8.11,27.13 R25.1
  Bottom Layer w0.152: USBC.3 2.06,26.03 SWD.6 SWD.7 ; 22.24,20.08 22.24,19.39 ; 23.74,20.08 23.74,19.39 ; 25.26,20.05 25.26,19.37
  Bottom Layer w0.203: 1,27.5 1,26.81 ; 1,18.76 1,18.07
  Bottom Layer w0.762: USBC.2 7.86,18.49 ; USBC.2 6.24,19.17 ; USBC.2 4.61,18.49 ; 6.24,26.41 USBC.1 ; USBC.4 3.68,18.49
  vias: v1(5.56,16.76) v1(11.75,12.61) v1(13.12,5.03) v1(13.74,22.73) v1(14.29,5.03) v1(20.18,18.67) v1(26.44,16.54) v1(29.17,16.2) v1(29.18,3.86) v1(29.94,13.99) v1(30.01,22.82) v1(30.01,22.37) v1(30.01,21.91) v1(30.09,25.62) v1(30.52,22.82) v1(30.52,22.37) v1(30.52,21.91) v1(30.59,25.62) v1(31.03,21.91) v2(6.6,2.59) v2(9.18,1.89) v2(9.18,1.38) v2(9.61,35.95) v2(9.69,1.89) v2(9.69,1.38) v2(10.2,1.89) v2(10.2,1.38) v2(10.35,15.34) v2(10.35,14.81) v2(10.35,14.29) v2(10.71,1.89) v2(10.71,1.38) v2(10.86,14.82) v2(10.86,14.29) v2(11.21,1.89) v2(11.21,1.38) v2(11.72,1.89) v2(11.72,1.38) v2(12.23,1.89) v2(12.23,1.38) v2(12.71,30.1) v2(12.74,1.89) v2(12.74,1.38) v2(12.97,26.65) v2(13.25,1.89) v2(13.25,1.38) v2(13.37,30.1) v2(13.37,29.55) v2(13.37,29.01) v2(13.64,26.65) v2(14.04,30.1) v2(14.04,29.55) v2(14.04,29.01) v2(14.31,26.65) v2(14.34,19.5) v2(14.71,29.55) v2(14.71,29.01) v2(15.41,20.38) v2(15.43,18.61) v2(18.17,28.7) v2(18.17,28.16) v2(18.17,27.61) v2(18.73,28.7) v2(18.73,28.16) v2(18.73,27.61) v2(19.75,22.35) v2(19.75,21.74) v2(19.75,21.17) v2(20.3,22.35) v2(20.3,21.74) v2(20.3,21.17) v2(20.84,22.35) v2(20.84,21.74) v2(20.84,21.17) v2(20.99,28.7) v2(20.99,28.16) v2(21.37,22.35) v2(21.37,21.74) v2(21.37,21.17) v2(21.55,28.7) v2(21.55,28.16) v2(21.92,22.35) v2(21.92,21.74) v2(21.92,21.17) v2(22.12,28.7) v2(22.12,28.16) v2(22.47,22.35) v2(22.47,21.74) v2(22.47,21.17) v2(22.68,28.7) v2(22.68,28.16) v2(23.03,21.74) v2(23.03,21.17) v2(23.57,21.74) v2(23.57,21.17) v2(24.12,21.74) v2(24.12,21.17) v2(24.71,26.57) v2(24.65,21.74) v2(24.65,21.17) v2(25.2,21.74) v2(25.2,21.17) v2(26.43,36.01) v2(26.43,35.46) v2(26.43,34.91) v2(26.99,36.01) v2(26.99,35.46) v2(26.99,34.91) v2(28.72,12.08) v2(28.72,11.52) v2(29.17,8.09) v2(29.17,7.46) v2(29.17,6.85) v2(29.72,8.09) v2(29.72,6.85) v2(30.26,8.09) v2(30.26,7.46) v2(30.26,6.85) v2(31.54,11.38) v2(32.1,11.38) v2(32.53,7.71) v2(32.66,11.38) v2(33.31,22.01) v2(35.5,27.26) v2(35.52,21.82) v2(35.5,20.26) v2(35.5,17.97)
VBAT: length 21.1
  Top Layer w0.152: C1C1.2 9.56,4.14
  Top Layer w0.254: R22.2 8.28,3.47 9.39,3.47 C1C1.2 ; R234.2 13.52,7.82 13.7,7.63 13.7,3.95 C1B1.2 ; R240.2 27.67,32.86 v2(27.29,33.24)
  Top Layer w0.457: MP9943_5V.7 9.3,6.27 9.56,6.01 ; v4(24.93,29.25) 25.26,29.58 MP9943_9V.7
  Top Layer w0.762: 9.56,6.01 9.56,4.14 ; v4(24.93,29.25) 24.04,29.25 23.47,29.82 C1C2.2
  Bottom Layer w0.254: v2(27.29,33.24) 26.2,33.24 25.67,32.7 25.67,29.99 v4(24.93,29.25)
  vias: v2(12.15,4.13) v2(12.15,3.62) v2(12.15,3.11) v2(12.62,4.13) v2(12.62,3.62) v2(12.62,3.11) v2(13.09,4.13) v2(13.09,3.62) v2(13.09,3.11) v2(13.55,4.13) v2(13.55,3.62) v2(13.55,3.11) v2(17.64,30.44) v2(17.64,29.99) v2(17.64,29.53) v2(18.19,30.44) v2(18.19,29.99) v2(18.19,29.53) v2(18.73,30.44) v2(18.73,29.99) v2(18.73,29.53) v2(23.94,36.06) v2(23.94,35.57) v2(23.94,35.07) v2(23.94,34.56) v2(23.94,34.07) v2(23.94,33.57) v2(24.44,36.06) v2(24.44,35.57) v2(24.44,35.07) v2(24.44,34.56) v2(24.44,34.07) v2(24.44,33.57) v2(24.96,36.06) v2(24.96,35.57) v2(24.96,35.07) v2(24.96,34.56) v2(24.96,34.07) v2(24.96,33.57) v2(25.46,36.06) v2(25.46,35.57) v2(25.46,35.07) v2(25.46,34.56) v2(25.46,34.07) v2(25.46,33.57)
ADC_CURR: length 44
  Top Layer w0.152: 11.75,32.12 11.74,32.12 ; ESC.8 11.8,32.2 11.8,35.46 ; v1(20.64,6.44) STM32F405.9
  PWR w0.254: v1(20.64,6.44) 20.64,7.18 19.75,8.07 15.86,8.07 14.47,9.46 14.47,13.75 13.73,14.49 13.73,15.74 11.82,17.64 11.82,18.48 v1(9.89,20.41)
  Bottom Layer w0.254: v2(11.8,35.46) NOREF#6.1 10.39,35.14 9.36,35.14 7.56,33.34 7.56,24.4 9.89,22.07 v1(9.89,20.41)
ADC_VBAT: length 20
  Top Layer w0.152: v1(21.14,6.69) STM32F405.10
  Top Layer w0.254: 7.45,3.18 7.45,2.54 v2(8.07,1.92) ; 7.45,3.18 7.46,3.17 ; 7.45,3.18 R21.2 8.21,4.18 R22.1
  Bottom Layer w0.254: v2(8.07,1.92) 8.67,2.53 14.39,2.53 19.06,7.2 20.62,7.2 v1(21.14,6.69)
BOOT0: length 5.7
  Top Layer w0.152: v1(13.66,9.52) STM32F405.60 ; v1(13.09,12.61) 13.09,13.41 BOOT.1
  PWR w0.152: v1(13.09,12.61) 13.66,12.04 v1(13.66,9.52)
BUZ-: length 6.8
  Top Layer w0.152: v1(10.71,31.79) 10,32.5 7.73,32.5 6.95,31.71 D1.2 6.91,31.69 Q1.3
BUZZER: length 27.9
  Top Layer w0.152: v1(18.28,11.54) 15.75,9.02 STM32F405.61
  PWR w0.152: v1(7.2,16.83) 7.86,17.49 7.86,25.89 v1(8.27,26.3)
  Bottom Layer w0.152: v1(7.2,16.83) 9.54,16.83 14.82,11.54 v1(18.28,11.54)
CAM: length 9.3
  Top Layer w0.152: v1(19.79,26.5) 20.66,26.5 C212.2 ; CAM.1 21.49,32.29 v1(20.99,31.79)
  Bottom Layer w0.152: v1(20.99,31.79) 20.99,30.67 20.46,30.14 20.46,27.17 v1(19.79,26.5)
D+: length 3.3
  Top Layer w0.152: R18.2 8,23.06 USBC.A6 ; 7.79,23.05 7.79,22.16 7.68,22.06 USBC.B6
D-: length 4.1
  Top Layer w0.152: USBC.A7 6.09,22.56 5.98,22.67 5.98,23.45 6.09,23.56 USBC.B7 8,23.56 R17.2
DC_5V: length 13.1
  PWR w0.381: v2(12.23,6.82) 12.94,7.53 12.94,11.67 12.33,12.28 12.33,15.41 v2(9.51,18.23)
DC_9V: length 4.5
  Top Layer w0.381: v2(23.93,26.56) R237.2
  Top Layer w0.508: DJI.1 29.63,21.03 29.12,21.54 29.12,22.41
  vias: v2(24.18,32.02) v2(24.18,31.56) v2(24.68,32.02) v2(24.68,31.56) v3(26.86,23.7) v3(26.86,23.14) v3(26.86,22.59) v3(27.42,23.7) v3(27.42,23.14) v3(27.42,22.59)
FLASH_CS: length 43.7
  Top Layer w0.152: STM32F405.8 20.15,5.53 v1(20.15,6.69) ; R11.1 14.05,25.95 15.79,25.95 v1(16.36,26.52)
  PWR w0.152: v1(16.36,26.52) 14.88,26.52 14.26,25.9 8.98,25.9 8.24,25.16 8.24,21.37 11.24,18.38 11.24,17.36 13.22,15.38 13.22,14.26 14.09,13.39 14.09,9.1 15.58,7.61 19.5,7.61 20.15,6.96 v1(20.15,6.69)
  Bottom Layer w0.152: v1(16.36,26.52) 16.88,27.04 16.88,27.98 16.37,28.49 15.35,28.49 G12.1
GYRO_1_CS: length 24.8
  Top Layer w0.152: v1(23.09,12.09) 22.47,11.46 22.47,8.83 22.8,8.49 24.75,8.49 25.28,9.02 STM32F405.20 ; ICM-42688P.12 28.42,4.31 v1(29.73,4.31) 30.14,4.31 R242.1
  PWR w0.152: v1(30.47,9.57) 31.46,8.58 31.46,5.4 30.37,4.31 v1(29.73,4.31)
  Bottom Layer w0.152: v1(23.09,12.09) 23.21,12.21 25.21,12.21 27.5,9.92 30.12,9.92 v1(30.47,9.57)
GYRO_1_EXTI: length 17.3
  Top Layer w0.152: v1(24.7,11.32) 25,11.02 STM32F405.24 ; ICM-42688P.4 v1(26.05,2.36) ; v1(27.98,9.45) MPU6000.12
  PWR w0.152: v1(24.7,11.32) 25.89,11.32 26.48,10.73 26.48,2.79 v1(26.05,2.36)
  Bottom Layer w0.152: G20.1 v1(24.7,11.32) 26.57,9.45 v1(27.98,9.45)
I2C1_SCL: length 46.9
  Top Layer w0.152: R30.1 13.65,11.09 13.65,10.78 13.91,10.52 STM32F405.58 v1(15.56,10.52) ; v1(25.29,1.44) BMP280.4 ; v1(33.45,15.38) GPS.5
  PWR w0.152: v1(25.29,1.44) 26.54,1.44 27.22,2.12 27.22,13.88 27.83,14.49 32.56,14.49 v1(33.45,15.38)
  Bottom Layer w0.152: v1(25.29,1.44) 25.29,4.91 19.68,10.52 v1(15.56,10.52) ; v1(33.45,15.38) 33.45,18.85 33.16,19.14 32.11,19.14 ; 32.11,19.14 v1(31.86,19.14) 31.86,19.14 32.11,19.14
I2C1_SDA: length 40.9
  Top Layer w0.152: BMP280.3 24.98,2.78 24.52,2.32 v1(24.52,1.44) ; R31.1 13.77,10.02 STM32F405.59 v1(15.87,10.02)
  PWR w0.152: v1(32.1,16.38) 32.1,15.33 31.64,14.87 27.65,14.87 26.86,14.08 26.86,2.3 26.43,1.87 24.96,1.87 v1(24.52,1.44)
  Bottom Layer w0.152: v1(15.87,10.02) 19.65,10.02 24.93,4.74 24.93,1.84 v1(24.52,1.44)
LED_FC: length 5.4
  Top Layer w0.152: v1(17.14,7.03) STM32F405.2
  Bottom Layer w0.152: v1(17.14,7.03) 17.13,7.03 v1(14.37,4.27)
LED_LXB: length 4.5
  Top Layer w0.152: STM32F405.3 17.64,5.53 v1(17.64,6.67)
  Bottom Layer w0.152: v1(17.64,6.67) v1(15.24,4.27)
LED_STRIP: length 27.1
  Top Layer w0.152: v1(25.04,13.08) 25.04,12.71 25.22,12.52 STM32F405.27
  Bottom Layer w0.152: v1(25.04,13.08) 25.04,15.65 24.07,16.62 18.45,16.62 17.31,17.77 17.31,28.33 16.96,28.69 16.96,31.18 NOREF#19.1
NRST: length 50.8
  Top Layer w0.152: v1(19.64,6.44) 19.64,5.53 STM32F405.7 ; v1(21.82,2.89) R16.1
  PWR w0.152: v1(6.03,28.44) 6.54,27.93 7.02,27.93 7.51,27.45 7.51,17.84 5.86,16.19 5.86,9.06 9.28,5.63 18.83,5.63 v1(19.64,6.44)
  Bottom Layer w0.152: v1(6.03,28.44) 4.56,28.44 4.1,27.98 4.1,22.97 4.3,22.78 SWD.3 ; v1(19.64,6.44) 21.82,4.26 v1(21.82,2.89)
OSC_IN: length 2.6
  Top Layer w0.152: X2.3 17.35,4.19 17.87,4.71 18.33,4.71 18.64,5.02 STM32F405.5
OSC_OUT: length 2.2
  Top Layer w0.152: STM32F405.6 19.14,4.84 19.27,4.71 19.62,4.71 19.75,4.59 19.75,3.76
S1: length 53.4
  Top Layer w0.152: v1(23.15,35.45) 23.15,34.33 22.82,34 17.26,34 16.87,33.61 ESC.3 ; STM32F405.37 v1(22.14,16.09)
  Bottom Layer w0.152: v1(22.14,16.09) 20.23,16.09 19.14,15 14.64,15 11.77,17.87 11.77,25.57 9.54,27.8 9.54,32.53 10,32.98 21.12,32.98 22.14,34 NOREF.1 23.14,35.46 v1(23.15,35.45)
S2: length 48.1
  Top Layer w0.152: v1(18.71,35.47) 18.05,34.81 17.06,34.81 15.87,33.63 ESC.4 ; v1(21.64,15.62) STM32F405.38
  Bottom Layer w0.152: v1(18.71,35.47) 19.84,35.47 NOREF#26.1 19.85,34.05 19.11,33.31 9.82,33.31 9.16,32.65 9.16,27.65 11.42,25.39 11.42,17.74 14.54,14.62 19.37,14.62 20.38,15.62 v1(21.64,15.62)
S3: length 45.5
  Top Layer w0.152: ESC.5 14.87,33.77 16.56,35.46 v1(17.56,35.46) ; v1(21.14,15.16) STM32F405.39
  Bottom Layer w0.152: v1(21.14,15.16) 20.46,15.16 19.59,14.29 14.44,14.29 11.06,17.67 11.06,25.21 8.78,27.5 8.78,32.8 9.61,33.64 17.08,33.64 17.56,34.13 v1(17.56,35.46)
S4: length 42.9
  Top Layer w0.152: v1(20.64,14.7) STM32F405.40 ; ESC.6 13.87,34.05 v1(15.28,35.46)
  Bottom Layer w0.152: v1(15.28,35.46) 15.28,34.33 14.92,33.97 9.39,33.97 8.4,32.98 8.4,27.34 10.71,25.03 10.71,17.56 14.32,13.95 19.9,13.95 v1(20.64,14.7)
SBUS: length 16
  Top Layer w0.152: DJI.6 33.43,26.03 33.97,25.49 v1(33.97,18.17) 33.11,17.31 30.49,17.31
  Bottom Layer w0.152: RC1.1 34.22,16.86 33.97,17.11 v1(33.97,18.17)
  vias: v1(35.52,16.45)
SPI1_CLK: length 17
  Top Layer w0.152: v1(23.09,8.93) 24.55,8.93 25.14,9.52 STM32F405.21 ; v1(28.32,3.23) 28.29,3.23 27.92,3.61 ICM-42688P.13 ; v1(29.98,5.52) 30.47,5.52 MPU6000.23
  PWR w0.152: v1(28.32,3.23) 28.32,5.21 28.64,5.52 v1(29.98,5.52)
  Bottom Layer w0.152: v1(29.98,5.52) 28.39,5.52 25.85,8.07 23.96,8.07 v1(23.09,8.93)
SPI1_MISO: length 14.8
  Top Layer w0.152: STM32F405.22 25.02,10.02 v1(24.7,9.7) ; v1(26.05,3.86) ICM-42688P.1
  PWR w0.152: v1(24.7,9.7) 25.51,9.7 26.05,9.16 v1(26.05,3.86)
  Bottom Layer w0.152: G18.1 v1(24.7,9.7) 25.46,8.93 29.58,8.93 v1(29.97,9.32)
SPI1_MOSI: length 20.2
  Top Layer w0.152: STM32F405.23 26.12,10.51 23.14,10.51 ; ICM-42688P.14 27.42,3.5 v1(27.67,3.24)
  PWR w0.152: v1(30.97,5.52) 30.46,6.03 28.26,6.03 27.67,5.45 v1(27.67,3.24)
  Bottom Layer w0.152: v1(30.97,5.52) 30.54,5.95 28.57,5.95 26.05,8.47 24.68,8.47 23.86,9.28 23.86,9.74 v1(23.09,10.51)
SPI2_CLK: length 3.1
  Top Layer w0.152: STM32F405.34 23.64,17.82 24.08,18.26 24.08,19.31 v2(24.5,19.73)
SPI2_MISO: length 6.9
  Top Layer w0.152: STM32F405.35 23.14,16.23 23.33,16.04 24.47,16.04 24.73,16.29 24.73,19.11 25.35,19.73 v2(26.03,19.73)
SPI2_MOSI: length 3.3
  Top Layer w0.152: STM32F405.36 22.64,17.68 22.83,17.87 23.05,17.87 23.43,18.25 23.43,19.3 v2(22.99,19.73)
SPI3_CLK: length 23
  Top Layer w0.152: STM32F405.55 16.44,12.02 16.96,12.54 16.96,14.19 v1(15.71,15.43) ; v1(11.4,29.06) W25Q128.6
  Bottom Layer w0.152: v1(15.71,15.43) 14.67,16.47 13.81,16.47 12.13,18.15 12.13,26.48 G11.1 11.08,28.74 v1(11.4,29.06)
SPI3_MISO: length 22.5
  Top Layer w0.152: STM32F405.56 16.58,11.52 17.36,12.31 17.36,14.49 16.42,15.43 v1(16.42,16.04)
  Bottom Layer w0.152: G10.1 12.84,24.4 12.84,18.63 14.31,17.16 15.3,17.16 v1(16.42,16.04)
  Bottom Layer w0.508: v1(16.33,27.79) 16.08,27.53 G10.1
SPI3_MOSI: length 26.5
  Top Layer w0.152: STM32F405.57 16.69,11.02 17.77,12.1 17.77,14.87 v1(17.13,15.51) ; v1(11.4,30.33) W25Q128.5
  Bottom Layer w0.152: v1(11.4,30.33) 12.73,28.99 G9.1 12.48,27.29 12.48,18.38 14.08,16.78 15.01,16.78 16.28,15.51 v1(17.13,15.51)
SWCLK: length 14
  Top Layer w0.152: STM32F405.49 14.95,15.02 v1(14.95,15.51)
  PWR w0.152: v1(9.4,21.46) 10.37,21.46 12.79,19.05 12.79,18.17 14.95,16.02 v1(14.95,15.51)
  Bottom Layer w0.152: SWD.1 8.71,20.78 v1(9.4,21.46)
SWDIO/OSD_CS: length 34.1
  Top Layer w0.152: 22.78,18.67 22.78,19.09 22.13,19.73 v2(21.5,19.73) ; v1(17.64,16.07) STM32F405.46 ; v1(18.71,24.78) 18.33,25.16 17,25.16 R243.1
  PWR w0.152: v1(9.13,21.96) 10.51,21.96 13.17,19.29 13.17,18.35 14.67,16.85 16.85,16.85 v1(17.64,16.07) 19.32,16.07 21.5,18.24 v2(21.5,19.73)
  Bottom Layer w0.152: v1(18.71,24.78) 18.71,20.3 19.27,19.73 v2(21.5,19.73) ; SWD.2 5.48,21.96 v1(9.13,21.96)
UART4_RX: length 33.4
  Top Layer w0.152: v1(33.39,24.03) 32.1,24.03 ; v1(24.22,6.64) 23.81,6.64 23.64,6.47 STM32F405.15
  PWR w0.152: v1(33.39,24.03) 34.91,22.51 34.91,8.33 v1(35.53,7.72)
  Bottom Layer w0.152: v1(35.53,7.72) 34.26,7.72 31.31,4.76 26.1,4.76 v1(24.22,6.64)
UART4_TX: length 33.1
  Top Layer w0.152: v1(23.81,7.07) 23.38,7.07 23.14,6.83 23.14,5.52 ; v1(33.39,23.03) 32.1,23.03
  PWR w0.152: v1(33.87,9.69) 34.53,10.35 34.53,21.89 v1(33.39,23.03)
  Bottom Layer w0.152: G2.1 34.18,10 v1(33.87,9.69) 33.87,7.82 31.14,5.09 26.48,5.09 24.5,7.07 v1(23.81,7.07)
UART5_RX: length 18.7
  Top Layer w0.152: v1(15.56,12.51) 15.55,12.52 STM32F405.54
  Bottom Layer w0.152: v1(15.56,12.51) 14.31,12.51 9.49,17.34 3.98,17.34 3.32,16.68 3.32,15.38 2,14.06 v1(1.89,14.06)
UART5_TX: length 17.7
  Top Layer w0.152: v1(15.86,13.02) 15.86,13.02 STM32F405.53
  Bottom Layer w0.152: NOREF#10.1 2,16.35 3.32,17.67 9.64,17.67 14.29,13.02 v1(15.86,13.02)
USART1_RX: length 24.7
  Top Layer w0.152: v1(19.14,17.82) 19.14,17.02 ; v1(35.53,12.29) 34.43,13.38 GPS.3
  Bottom Layer w0.152: v1(35.53,12.29) 34.02,12.29 33.07,13.24 28.95,13.24 28.26,13.93 28.26,16.24 27.52,16.98 19.98,16.98 v1(19.14,17.82)
USART1_TX: length 23.8
  Top Layer w0.152: v1(19.8,17.82) 19.64,17.66 STM32F405.42 ; v1(35.53,14.38) 32.1,14.38
  Bottom Layer w0.152: v1(35.53,14.38) G7.1 34.03,14.57 33.02,13.56 29.11,13.56 28.64,14.03 28.64,16.4 27.7,17.34 20.28,17.34 v1(19.8,17.82)
USART2_RX: length 54.8
  Top Layer w0.152: v1(24.4,4.61) 24.68,4.89 24.68,7.28 v1(24.92,7.52) STM32F405.17 ; R26.1 27.77,19.1 27.86,19.19 Q2.3 ; v1(1.89,12.23) 2.71,12.23 3.14,12.66 3.14,14.63 3.63,15.13 ELRS.1
  PWR w0.152: v1(24.92,7.52) 23.71,8.73 23.71,16.83 24.96,18.07 v1(27.78,18.07)
  Bottom Layer w0.152: G13.1 2.02,11.78 3.24,10.55 3.24,9.03 6.46,5.81 14.68,5.81 16.96,8.09 20.92,8.09 24.4,4.61
USART2_TX: length 34.7
  Top Layer w0.152: v1(23.38,4.61) 23.71,4.61 24.14,5.04 STM32F405.16 ; v1(1.89,9.49) 3.4,9.49 3.7,9.79 3.7,13.8 4.02,14.13 ELRS.2
  Bottom Layer w0.152: v1(23.38,4.61) 23.38,5.12 20.84,7.66 17.11,7.66 14.92,5.47 6.12,5.47 2.1,9.49 v1(1.89,9.49)
USART3_RX: length 33.7
  Top Layer w0.152: ESC.7 12.87,35.45 v1(12.87,35.46) ; STM32F405.52 14.64,13.53 v1(15.56,13.53)
  Bottom Layer w0.152: v1(12.87,35.46) 12.87,35.17 12.03,34.33 9.21,34.33 8.01,33.13 8.01,27.22 10.35,24.88 10.35,17.44 14.26,13.53 v1(15.56,13.53)
USART3_TX: length 29.2
  Top Layer w0.152: v1(16.4,13.53) 15.9,14.02 STM32F405.51
  PWR w0.152: v1(27.04,18.68) 23.33,18.68 18.17,13.53 v1(16.4,13.53)
  Bottom Layer w0.152: VTX.2 33.68,25.05 34.08,24.65 34.08,21.7 33.67,21.3 27.7,21.3 27.04,20.64 v1(27.04,18.68)
USB_5V: length 7.9
  Top Layer w0.381: 5.37,25.06 USBC.B9 ; 6.89,20.56 5.38,20.56
  Top Layer w0.508: 5.38,20.56 4.94,20.99 4.94,24.63 5.37,25.06
USB_DM: length 15.8
  Top Layer w0.152: v1(18.71,18.23) 18.71,17.8 18.64,17.73 STM32F405.44 ; v1(9.65,23.63) 9.29,23.63 R17.1
  PWR w0.152: v1(9.65,23.63) 10.08,23.63 10.24,23.46 17.99,23.46 18.54,22.91 18.54,18.72 18.71,18.55 v1(18.71,18.23)
USB_DP: length 15.8
  Top Layer w0.152: v1(9.65,22.99) 9.29,22.99 R18.1 ; v1(18.07,18.23) 18.07,17.8 18.14,17.73 STM32F405.45
  PWR w0.152: v1(18.07,18.23) 18.07,18.55 18.24,18.72 18.24,22.79 17.87,23.16 12.69,23.16 12.38,22.85 12.23,22.85 11.92,23.16 11.77,23.16 11.47,22.85 11.31,22.85 11.01,23.16 10.24,23.16 10.08,22.99 v1(9.65,22.99)
VTX: length 21.5
  PWR w0.152: v1(33.44,26.73) 30.95,24.24 20.46,24.24 19.47,25.24 v1(15.22,25.24)
  Bottom Layer w0.152: v1(33.44,26.73) 33.44,26.25 33.24,26.05 VTX.1
$1N30037: length 2.1
  Top Layer w0.152: R24.1 R25.2 9.14,28.3 Q1.1
$1N30154: length 0.8
  Top Layer w0.152: 14.37,3.35 R4.1
$1N30155: length 0.8
  Top Layer w0.152: LXB.2 R3.1
$1N30264: length 1.3
  Top Layer w0.152: R27.1 29.63,17.84 30.01,18.23 30.24,18.23
$1N77134: length 4
  Top Layer w0.152: STM32F405.31 26.87,14.52 27.01,14.67 27.01,17.18 26.89,17.31 C242.1
$1N77171: length 2.3
  Top Layer w0.152: STM32F405.47 17.14,17.74 16.98,17.89 16.4,17.89 15.96,17.46 C243.1
$1N77291: length 5.4
  Top Layer w0.152: STM32F405.28 26.92,13.02 27.42,13.53 28.72,13.53 28.89,13.35 28.89,12.87 29.38,12.38 30.11,12.38 30.39,12.1 R23.2
$1N114320: length 0.8
  Top Layer w0.152: 16.09,3.35 R244.1
$2N12790: length 6.7
  Top Layer w0.381: L201.1 9.53,9.7 C203.2
  Top Layer w0.457: MP9943_5V.6 9.33,6.92 9.56,7.15
  Top Layer w0.762: 9.56,9.28 9.56,7.15
$2N12803: length 0.9
  Top Layer w0.381: C203.1 13.11,8.79 R230.2
$2N12807: length 1.9
  Top Layer w0.381: R233.2 11.03,5.02 10.86,5.2 MP9943_5V.1
$2N12810: length 1.8
  Top Layer w0.381: R233.1 R232.2 13.09,5.92 R231.1
$2N12815: length 2.3
  Top Layer w0.254: R230.1 11.75,8.77 11.6,8.62 11.6,7.89 11.28,7.57 10.86,7.57
$2N12817: length 1.7
  Top Layer w0.254: MP9943_5V.3 11.33,6.92 R234.1
$2N12824: length 1.5
  Top Layer w0.254: R235.1 7.18,5.23 7.57,5.62 MP9943_5V.8
$2N12827: length 5.2
  Top Layer w0.254: R235.2 v2(7.02,7.08)
  Bottom Layer w0.254: v2(7.02,7.08) 7.84,6.27 v2(10.86,6.27)
$2N13284: length 6.4
  Top Layer w0.254: 29.27,30.51 29.27,31.61
  Top Layer w0.457: MP9943_9V.6 25.92,29.58 26.25,29.25
  Top Layer w0.762: L202.1 28.86,30.51 27.6,29.25 26.25,29.25
$2N13297: length 0.7
  Top Layer w0.254: R236.2 30.86,31.61 C245.1
$2N13301: length 1.6
  Top Layer w0.254: MP9943_9V.1 24.61,27.56 24.45,27.39 23.44,27.39
$2N13304: length 1.8
  Top Layer w0.254: 22.58,27.39 22.58,26.57 ; R237.1 22.58,26.56 R238.2
$2N13309: length 9.8
  Top Layer w0.254: R236.1 v2(32.3,31.62) ; v2(27.1,27.91) MP9943_9V.4
  PWR w0.381: v2(32.3,31.62) 27.55,31.62 27.1,31.16 v2(27.1,27.91)
$2N13311: length 7.3
  Top Layer w0.254: v2(28.54,32.45) R240.1
  PWR w0.381: v2(28.54,32.45) 27.11,32.45 25.92,31.25 v2(25.92,27.91)
$2N13318: length 6.8
  Top Layer w0.254: v2(27.18,27.18) 27.18,26.57
  PWR w0.381: v2(27.18,27.18) 24.58,27.18 24.14,27.62 24.14,29.94 v2(24.61,30.41)
$2N13321: length 2.2
  Top Layer w0.254: MP9943_9V.2 25.26,26.87 C246.2 26.31,26.57 R241.2
$3N286: length 1.1
  Top Layer w0.152: C40.1 29.68,10.35 29.47,10.14 MPU6000.10
$3N290: length 3.2
  Top Layer w0.152: MPU6000.20 28.97,4.91 28.82,4.76 27.72,4.76 27.27,5.22 C42.1
$3N1236: length 7.2
  Top Layer w0.152: X3.1 16.78,20.63 18.13,20.63 18.23,20.53 18.23,20.31 18.12,20.21 17.89,20.21 17.79,20.1 17.79,19.88 17.89,19.77 20.77,19.77 21.48,19.06 21.48,18.67
$3N1237: length 7.4
  Top Layer w0.152: 20.83,18.67 20.83,19.1 20.46,19.47 15.25,19.47 14.51,18.73 14.33,18.73
$3N1238: length 4.3
  Top Layer w0.152: 25.38,18.67 25.38,18.28 26.89,18.28 27.32,17.84 27.32,16.65 27.45,16.52 27.85,16.52
$3N1240: length 2.9
  Top Layer w0.152: AT7456E.17 25.38,24.68 26.84,24.68 27.16,25 R208.1
$3N1241: length 1.3
  Top Layer w0.152: AT7456E.18 24.73,25.67 R209.1
$3N1242: length 1.4
  Top Layer w0.152: AT7456E.19 24.08,25.59 R210.1
$3N1247: length 2.2
  Top Layer w0.152: AT7456E.22 22.13,24.84 21.76,25.21 21.1,25.21 C212.1
$3N1251: length 3.1
  Top Layer w0.152: C207.2 14.55,24.16 14.35,24.36 R212.1
$3N1252: length 5.7
  Top Layer w0.254: AT7456E.25 20.18,23.76 19.92,23.51 18.66,23.51 17.87,22.72 16.66,22.72 16.4,22.47 C207.1
$3N1253: length 6.9
  Top Layer w0.254: C208.1 14.48,22.76 14.97,23.25 17.54,23.25 18.35,24.07 19.53,24.07 AT7456E.26

## Copper pours and planes (outline as drawn; the poured copper is in the pictures)
5V on Top Layer: 29.63,16.83 30.93,16.83 30.93,14.44 29.63,14.44
5V on Top Layer: 11.21,22.52 13.37,22.52 13.37,18.2 11.21,18.2
GND on Top Layer: -1.28,39.46 39,39.46 39,-2.25 -1.28,-2.25
GND on Top Layer: 17.31,28.99 23.66,28.99 23.66,26.33 17.31,26.33
GND on Top Layer: 8.83,3.09 13.83,3.09 13.83,1.05 8.83,1.05
GND on Top Layer: 10.07,19.47 11.47,19.47 11.47,13.88 10.07,13.88
GND on Top Layer: 29.63,25.95 33.06,25.95 33.06,21.55 29.63,21.55
GND on Bottom Layer: -2.3,38.29 40.63,38.29 40.63,-1.54 -2.3,-1.54
GND on GND: 0.15,37.26 37.26,37.26 37.26,0.16 0.15,0.16
VBAT on Top Layer: 8.83,4.53 13.83,4.53 13.83,2.83 8.83,2.83
VBAT on Top Layer: 17.31,32.98 23.79,32.98 23.79,29.25 17.31,29.25
VBAT on Bottom Layer: 23.64,36.44 25.72,36.44 25.72,33.24 23.64,33.24
VBAT on PWR: 2.45,34.81 25.72,34.81 25.72,2.58 2.45,2.58
DC_5V on Top Layer: 7.02,19.47 11.21,19.47 11.21,12.1 7.02,12.1
DC_9V on Top Layer: 26.56,27.72 31.79,27.72 31.79,22.01 26.56,22.01
DC_9V on Top Layer: 23.94,33.13 24.91,33.13 24.91,31.31 23.94,31.31
DC_9V on Bottom Layer: 23.2,32.8 32.98,32.8 32.98,22.26 23.2,22.26
USB_5V on Top Layer: 5.88,21.58 8.7,21.58 8.7,20.1 5.88,20.1
$2N12790 on Top Layer: 7.02,10.2 11.21,10.2 11.21,8.04 7.02,8.04
$2N13284 on Top Layer: 27.6,31.03 31.79,31.03 31.79,29.5 27.6,29.5

Small or netless copper shapes (teardrops, artwork), in the pictures only: 34 on Bottom Layer

## Text on the board
Bottom Silkscreen Layer: NRST | SWDIO | 9V | GND | 3V3 | VTX | T3 | SWCLK | 5V | RGB | BUZ | T1 | R1 | T4 | S3 | BAT | G | R5 | T2 | SCK | CS | SCL | R4 | CUR | S4 | S1 | T5 | R2 | MISO | SDA | Sbus | R3 | S2 | MOSI | EXTI | Flash | OSD | GYRO
Top Silkscreen Layer: ADC | BAT | G | T | 9 | R | 5 | S | A | L | C | 2 | 1 | 4 | V | 3 | CAM | 9V | GND | 5V | R2 | T2 | BEC1 | BEC2 | RCF4 | *开发调试中
